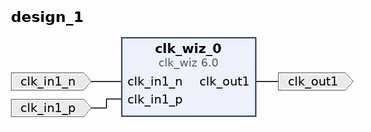
[diagram p0: block diagram of the top level]
# Vivado block design design_1, xc7k325tffg900-2, Vivado 2020.2
create_bd_design design_1

create_bd_port -dir O -type clk clk_out1
create_bd_port -dir I -type clk clk_in1_n
set_property -dict {CONFIG.FREQ_HZ 200000000} [get_bd_ports clk_in1_n]
create_bd_port -dir I -type clk clk_in1_p
set_property -dict {CONFIG.FREQ_HZ 200000000} [get_bd_ports clk_in1_p]

create_bd_cell -type ip -vlnv xilinx.com:ip:clk_wiz:6.0 clk_wiz_0
set_property -dict [list \
  CONFIG.CLKIN1_JITTER_PS 50.0 \
  CONFIG.CLKOUT1_JITTER 112.316 \
  CONFIG.CLKOUT1_PHASE_ERROR 89.971 \
  CONFIG.CLK_IN1_BOARD_INTERFACE sys_diff_clock \
  CONFIG.MMCM_CLKFBOUT_MULT_F 5.000 \
  CONFIG.MMCM_CLKIN1_PERIOD 5.000 \
  CONFIG.MMCM_CLKIN2_PERIOD 10.0 \
  CONFIG.PRIM_SOURCE Differential_clock_capable_pin \
] [get_bd_cells clk_wiz_0]

# ---- connections ----

connect_bd_net [get_bd_pins clk_wiz_0/clk_out1] [get_bd_ports clk_out1]
connect_bd_net [get_bd_ports clk_in1_n] [get_bd_pins clk_wiz_0/clk_in1_n]
connect_bd_net [get_bd_ports clk_in1_p] [get_bd_pins clk_wiz_0/clk_in1_p]

validate_bd_design
save_bd_design
